# Altium schematic sheet Audio Codec.SchDoc
size 297 x 209 mm; SheetNumber: 18; SheetTotal: 29
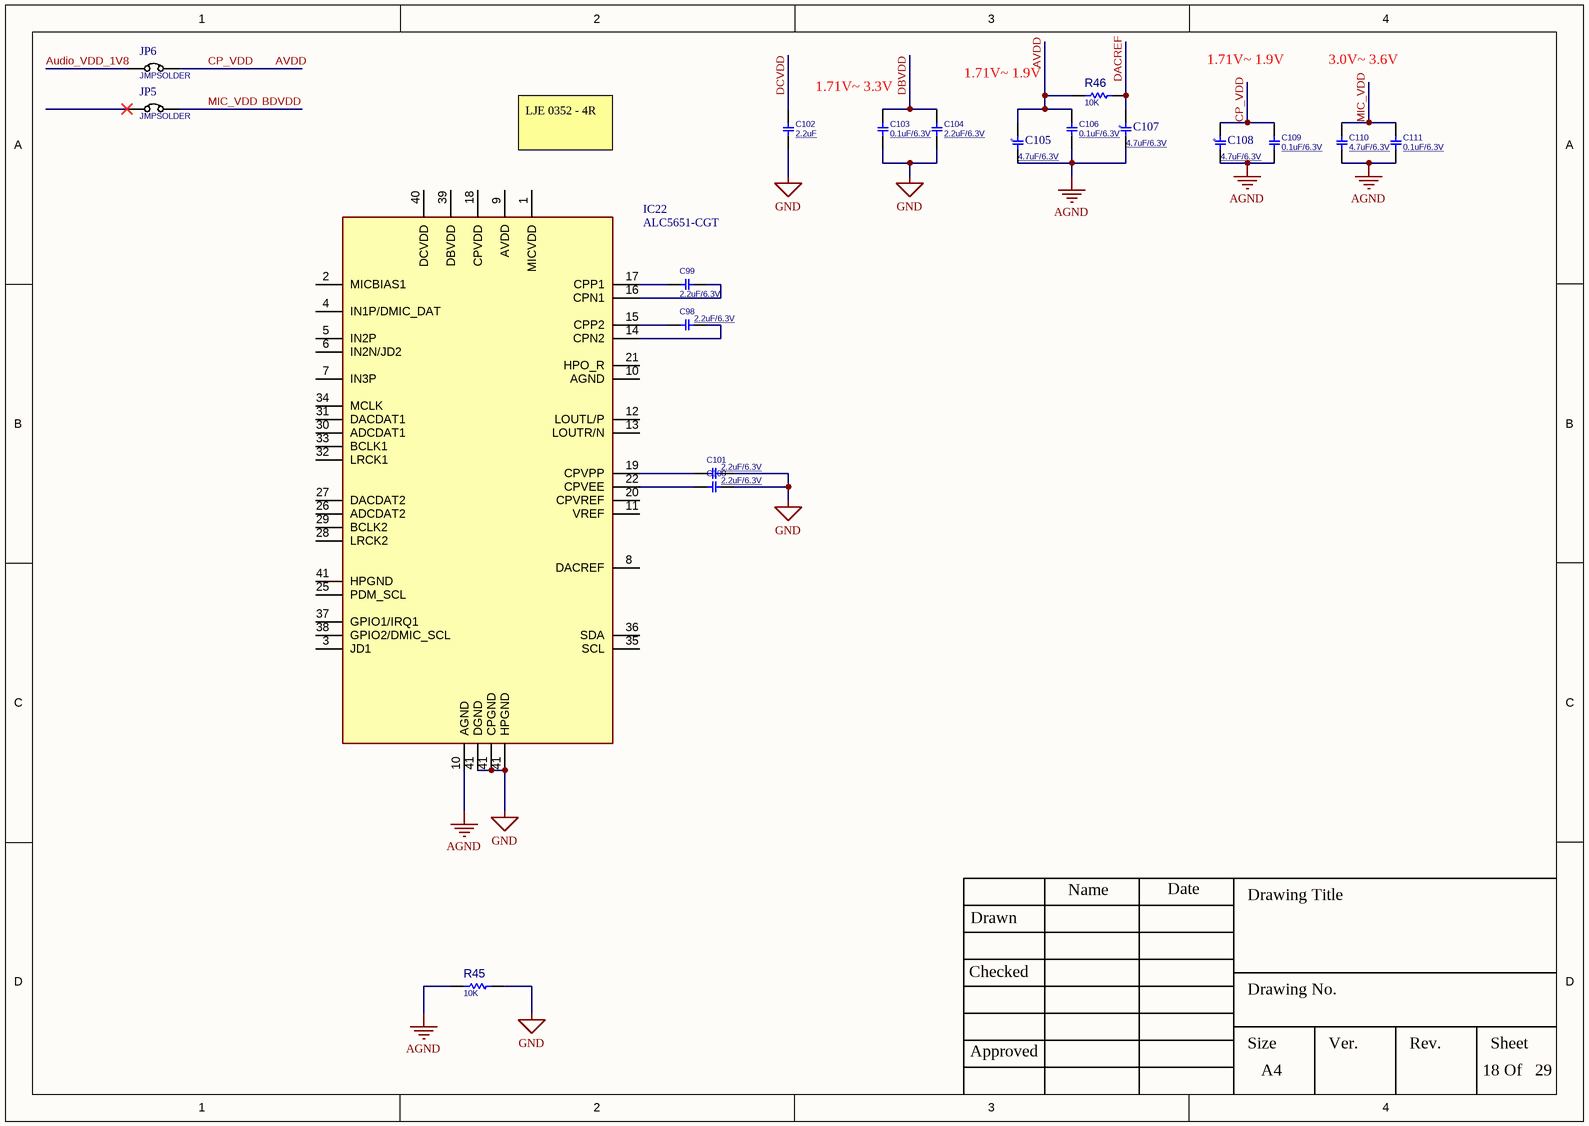
[diagram p0: Audio Codec.SchDoc]

## Parts
C98  2.2uF/6.3V  [C0603]
C99  2.2uF/6.3V  [C0603]
C100  2.2uF/6.3V  [C0603]
C101  2.2uF/6.3V  [C0603]
C102  2.2uF  [C0603]
C103  0.1uF/6.3V  [C0603]
C104  2.2uF/6.3V  [C0603]
C105  value 4.7uF/6.3V  [Cap_A]  (hidden comment: Capacitor Tantalum SMD)
C106  0.1uF/6.3V  [C0603]
C107  value 4.7uF/6.3V  [Cap_A]  (hidden comment: Capacitor Tantalum SMD)
C108  value 4.7uF/6.3V  [Cap_A]  (hidden comment: Capacitor Tantalum SMD)
C109  0.1uF/6.3V  [C0603]
C110  4.7uF/6.3V  [C0805]
C111  0.1uF/6.3V  [C0603]
IC22  ALC5651-CGT  [QFN40P500X500X90-41N-D]
JP5  JMPSOLDER  [JP_40X50]
JP6  JMPSOLDER  [JP_40X50]
R45  10K  [R0603]
R46  10K  [R0603]

## Nets
AGND: C105.1 C106.1 C107.1 C108.1 C109.1 C110.2 C111.2 IC22.10(AGND) R45.1
GND: C100.1 C101.1 C102.1 C103.1 C104.1 IC22.41(HPGND) R45.2
Audio_VDD_1V8: JP6.1
AVDD: C105.2 C106.2 C108.2 C109.2 JP6.2 R46.1  [also labelled CP_VDD]
BDVDD: C110.1 C111.1 JP5.2  [also labelled MIC_VDD]
DACREF: C107.2 R46.2
DBVDD: C103.2 C104.2
DCVDD: C102.2
NetC98_1: C98.1 IC22.14(CPN2)
NetC98_2: C98.2 IC22.15(CPP2)
NetC99_1: C99.1 IC22.17(CPP1)
NetC99_2: C99.2 IC22.16(CPN1)
NetC100_2: C100.2 IC22.22(CPVEE)
NetC101_2: C101.2 IC22.19(CPVPP)

Not connected (* = marked no-connect by the designer): IC22 1(MICVDD) 2(MICBIAS1) 3(JD1) 4(IN1P/DMIC_DAT) 5(IN2P) 6(IN2N/JD2) 7(IN3P) 8(DACREF) 9(AVDD) 11(VREF) 12(LOUTL/P) 13(LOUTR/N) 18(CPVDD) 20(CPVREF) 21(HPO_R) 25(PDM_SCL) 26(ADCDAT2) 27(DACDAT2) 28(LRCK2) 29(BCLK2) 30(ADCDAT1) 31(DACDAT1) 32(LRCK1) 33(BCLK1) 34(MCLK) 35(SCL) 36(SDA) 37(GPIO1/IRQ1) 38(GPIO2/DMIC_SCL) 39(DBVDD) 40(DCVDD); JP5 1*

## Notes on the sheet
- 1.71V~ 1.9V
- 3.0V~ 3.6V
- 1.71V~ 3.3V
- LJE 0352 - 4R
- Drawn
- Name
- Date
- Drawing Title
- Checked
- Drawing No.
- Approved
- Size
- A4
- Ver.
- Rev.
- Sheet
- Of
- (in symbol Capacitor Tantalum SMD) +

## Library data of the parts
C98-C104 C106 C109 C111 = CAP_SMD_MLCC_0603: CAP, MLCC, -F, -V, MATERIAL, -%, 0201; PARAM: -, -%; MANF_P#: MANF_PART#; PRICE: 100= 1$; MANF: -; PARAM2: -V; ASSEMBLY: ASSEMBLY
  C98-C101 C104: VALUE: 2.2uF/6.3V
  C102: VALUE: 2.2uF
  C103 C106 C109 C111: VALUE: 0.1uF/6.3V
C110 = CAP_SMD_MLCC_0805: CAP, MLCC, -F, -V, MATERIAL, -%, 0201; PARAM: -, -%; MANF_P#: MANF_PART#; PRICE: 100= 1$; MANF: -; PARAM2: -V; ASSEMBLY: ASSEMBLY; VALUE: 4.7uF/6.3V
IC22 = ALC5651-CGT: Integrated Circuit; Manufacturer_Name: Realtek; Datasheet Link: https://datasheet.lcsc.com/szlcsc/2001151131_Realtek-Semicon-ALC5651-CGT_C474323.pdf; Height: 0.9mm; Manufacturer_Part_Number: ALC5651-CGT
JP5 JP6 = JUMPER_SOLDER: JUMPER, HEADER 2PIN; MANF: MANF; MANF_P#: MANF_P#; VALUE: JMPSOLDER
R45 R46 = RES_SMD_0603: RESISTOR, SMD; PARAM: -W; DESC: DESCRIPTION; DIST#: MOUSER; PARAM2: 1%; MANF_P#: -; MANF: -; ASSEMBLY: ASSEMBLY; PRICE: 100= 0.5$; VALUE: 10K
C105 C107 C108 = Capacitor Tantalum SMD: DatasheetVersion: 2021; ComponentLink1Description: Website Smart World; ComponentLink1URL: https://www.smartw.ir/; ComponentLink2Description: Telegram; ComponentLink2URL: https://t.me/altium_smartw; ComponentLink3Description: Instagram; ComponentLink3URL: https://Instagram.com/smartgw.ir